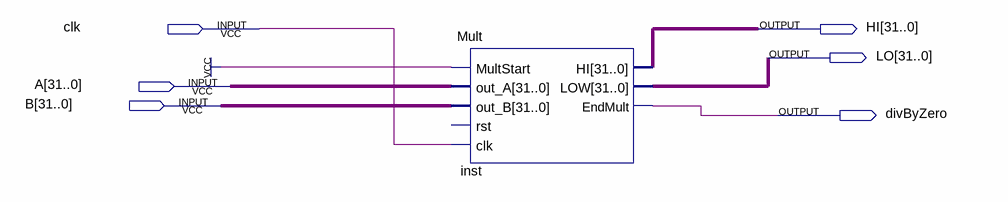
[diagram p0: schematic sheet]
// Quartus schematic div_teste.bdf as structural Verilog: 1 symbols, 6 pins
module div_teste (
  input  clk,
  input  [31:0] A,
  input  [31:0] B,
  output [31:0] HI,
  output [31:0] LO,
  output divByZero
);

  Mult inst (.MultStart(1'b1), .out_A(A), .out_B(B), .clk(clk), .HI(HI), .LOW(LO), .EndMult(divByZero));  // open: rst
endmodule
